# EasyEDA schematic Swap Plate.json
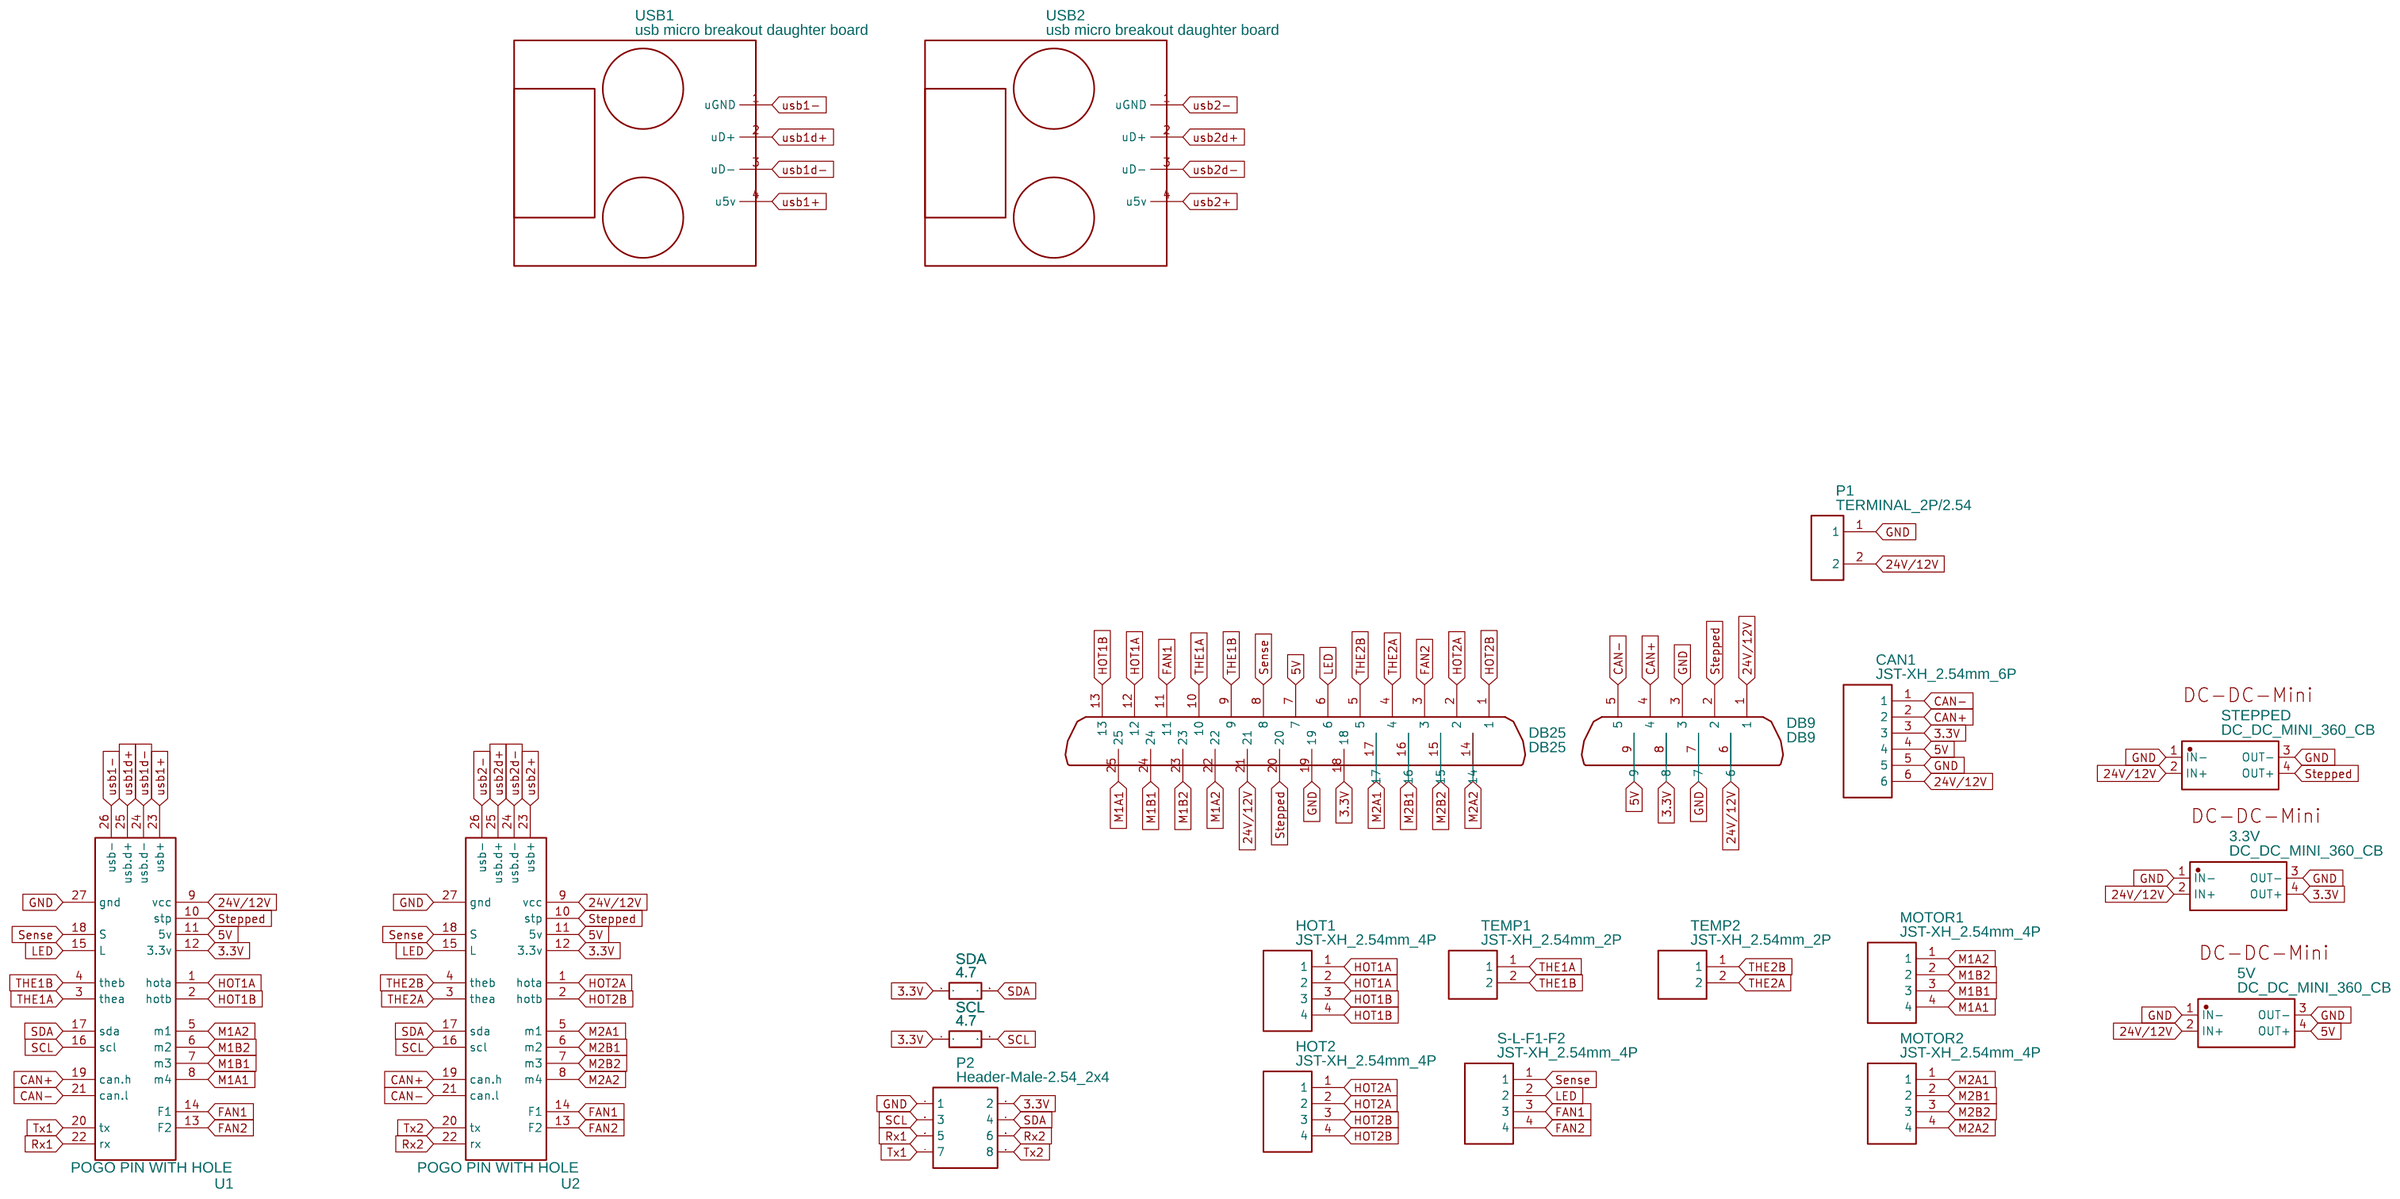
[diagram p0: schematic sheet]

## Parts
3.3V  DC_DC_MINI_360_CB  [MINI_360_CB2]
5V  DC_DC_MINI_360_CB  [MINI_360_CB2]
CAN1  JST-XH_2.54mm_6P  [JST-XH_2.54MM_6P]
DB9  DB9  [DB9]
DB25  DB25  [DB25-VIA]
HOT1  JST-XH_2.54mm_4P  [JST-XH_2.54MM_4P]
HOT2  JST-XH_2.54mm_4P  [JST-XH_2.54MM_4P]
MOTOR1  JST-XH_2.54mm_4P  [JST-XH_2.54MM_4P]
MOTOR2  JST-XH_2.54mm_4P  [JST-XH_2.54MM_4P]
P1  TERMINAL_2P/2.54  [5.08-2P_SCREW_TERMINAL]
P2  Header-Male-2.54_2x4  [HDR-TH_8P-P2.54-V-M-R2-C4-S2.54]
S-L-F1-F2  JST-XH_2.54mm_4P  [JST-XH_2.54MM_4P]
SCL  4.7  [R0603]
SDA  4.7  [R0603]
STEPPED  DC_DC_MINI_360_CB  [MINI_360_CB2]
TEMP1  JST-XH_2.54mm_2P  [JST-XH_2.54MM_2P]
TEMP2  JST-XH_2.54mm_2P  [JST-XH_2.54MM_2P]
U1  POGO PIN WITH HOLE  [POGO ARRAY WITH 16MM HOLE]
U2  POGO PIN WITH HOLE  [POGO ARRAY WITH 16MM HOLE]
USB1  usb micro breakout daughter board  [MICRO USB BREAK OUT DAUGHTER BOARD]
USB2  usb micro breakout daughter board  [MICRO USB BREAK OUT DAUGHTER BOARD]

## Library data of the parts
3.3V 5V STEPPED = DC_DC_MINI_360_CB: Manufacturer Part: Grobbling Sphincter; Contributor: clivebagley; Manufacturer: Arse End Industries
CAN1 = JST-XH_2.54mm_6P: Contributor: Abdussamet KACI
DB9 = DB9: Contributor: lauryn Gao
DB25 = DB25: Contributor: lauryn Gao
HOT1 HOT2 MOTOR1 MOTOR2 S-L-F1-F2 = JST-XH_2.54mm_4P: Contributor: abdussamet28051999
P1 = TERMINAL_2P/2.54: Manufacturer Part: Screw terminal 2p; Contributor: Giuseppe Fusi
P2 = Header-Male-2.54_2x4: Supplier: LCSC; Manufacturer: ReliaPro; Manufacturer Part: Header2X4P 2.54mm; image: http://image.lceda.cn/szlcsc/C58363.jpg; Supplier Part: C58363
SCL SDA = R_0603_EU: Contributor: LCEDA_Lib
TEMP1 TEMP2 = JST-XH_2.54mm_2P: Contributor: abdussamet28051999
U1 U2 = POGO PIN WITH HOLE: Contributor: atanasovgoran94
USB1 USB2 = usb micro breakout daughter board: Contributor: atanasovgoran94

## Nets
3.3V: 3.3V.4(OUT+) CAN1.3 DB9.8 DB25.18 P2.2 SCL.1 SDA.1 U1.12(3.3v) U2.12(3.3v)
5V: 5V.4(OUT+) CAN1.4 DB9.9 DB25.7 U1.11(5v) U2.11(5v)
24V/12V: 3.3V.2(IN+) 5V.2(IN+) CAN1.6 DB9.1 DB9.6 DB25.21 P1.2 STEPPED.2(IN+) U1.9(vcc) U2.9(vcc)
GND: 3.3V.1(IN-) 3.3V.3(OUT-) 5V.1(IN-) 5V.3(OUT-) CAN1.5 DB9.3 DB9.7 DB25.19 P1.1 P2.1 STEPPED.1(IN-) STEPPED.3(OUT-) U1.27(gnd) U2.27(gnd)
CAN+: CAN1.2 DB9.4 U1.19(can.h) U2.19(can.h)
CAN-: CAN1.1 DB9.5 U1.21(can.l) U2.21(can.l)
FAN1: DB25.11 S-L-F1-F2.3 U1.14(F1) U2.14(F1)
FAN2: DB25.3 S-L-F1-F2.4 U1.13(F2) U2.13(F2)
HOT1A: DB25.12 HOT1.1 HOT1.2 U1.1(hota)
HOT1B: DB25.13 HOT1.3 HOT1.4 U1.2(hotb)
HOT2A: DB25.2 HOT2.1 HOT2.2 U2.1(hota)
HOT2B: DB25.1 HOT2.3 HOT2.4 U2.2(hotb)
LED: DB25.6 S-L-F1-F2.2 U1.15(L) U2.15(L)
M1A1: DB25.25 MOTOR1.4 U1.8(m4)
M1A2: DB25.22 MOTOR1.1 U1.5(m1)
M1B1: DB25.24 MOTOR1.3 U1.7(m3)
M1B2: DB25.23 MOTOR1.2 U1.6(m2)
M2A1: DB25.17 MOTOR2.1 U2.5(m1)
M2A2: DB25.14 MOTOR2.4 U2.8(m4)
M2B1: DB25.16 MOTOR2.2 U2.6(m2)
M2B2: DB25.15 MOTOR2.3 U2.7(m3)
Rx1: P2.5 U1.22(rx)
Rx2: P2.6 U2.22(rx)
SCL: P2.3 SCL.2 U1.16(scl) U2.16(scl)
SDA: P2.4 SDA.2 U1.17(sda) U2.17(sda)
Sense: DB25.8 S-L-F1-F2.1 U1.18(S) U2.18(S)
Stepped: DB9.2 DB25.20 STEPPED.4(OUT+) U1.10(stp) U2.10(stp)
THE1A: DB25.10 TEMP1.1 U1.3(thea)
THE1B: DB25.9 TEMP1.2 U1.4(theb)
THE2A: DB25.4 TEMP2.2 U2.3(thea)
THE2B: DB25.5 TEMP2.1 U2.4(theb)
Tx1: P2.7 U1.20(tx)
Tx2: P2.8 U2.20(tx)
usb1+: U1.23(usb+) USB1.4(u5v)
usb1-: U1.26(usb-) USB1.1(uGND)
usb1d+: U1.25(usb.d+) USB1.2(uD+)
usb1d-: U1.24(usb.d-) USB1.3(uD-)
usb2+: U2.23(usb+) USB2.4(u5v)
usb2-: U2.26(usb-) USB2.1(uGND)
usb2d+: U2.25(usb.d+) USB2.2(uD+)
usb2d-: U2.24(usb.d-) USB2.3(uD-)
